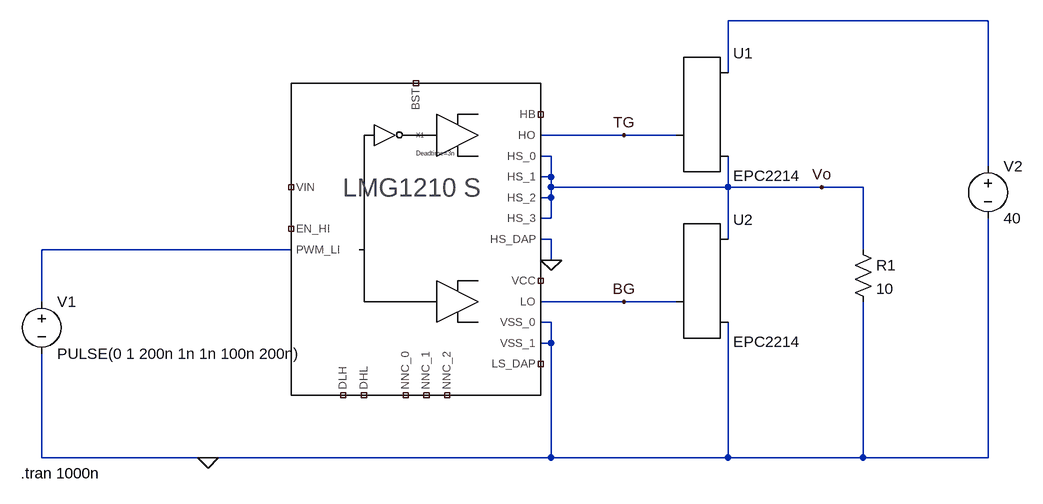
[diagram p0: schematic LMG1210-simple-test-circuit.asc]
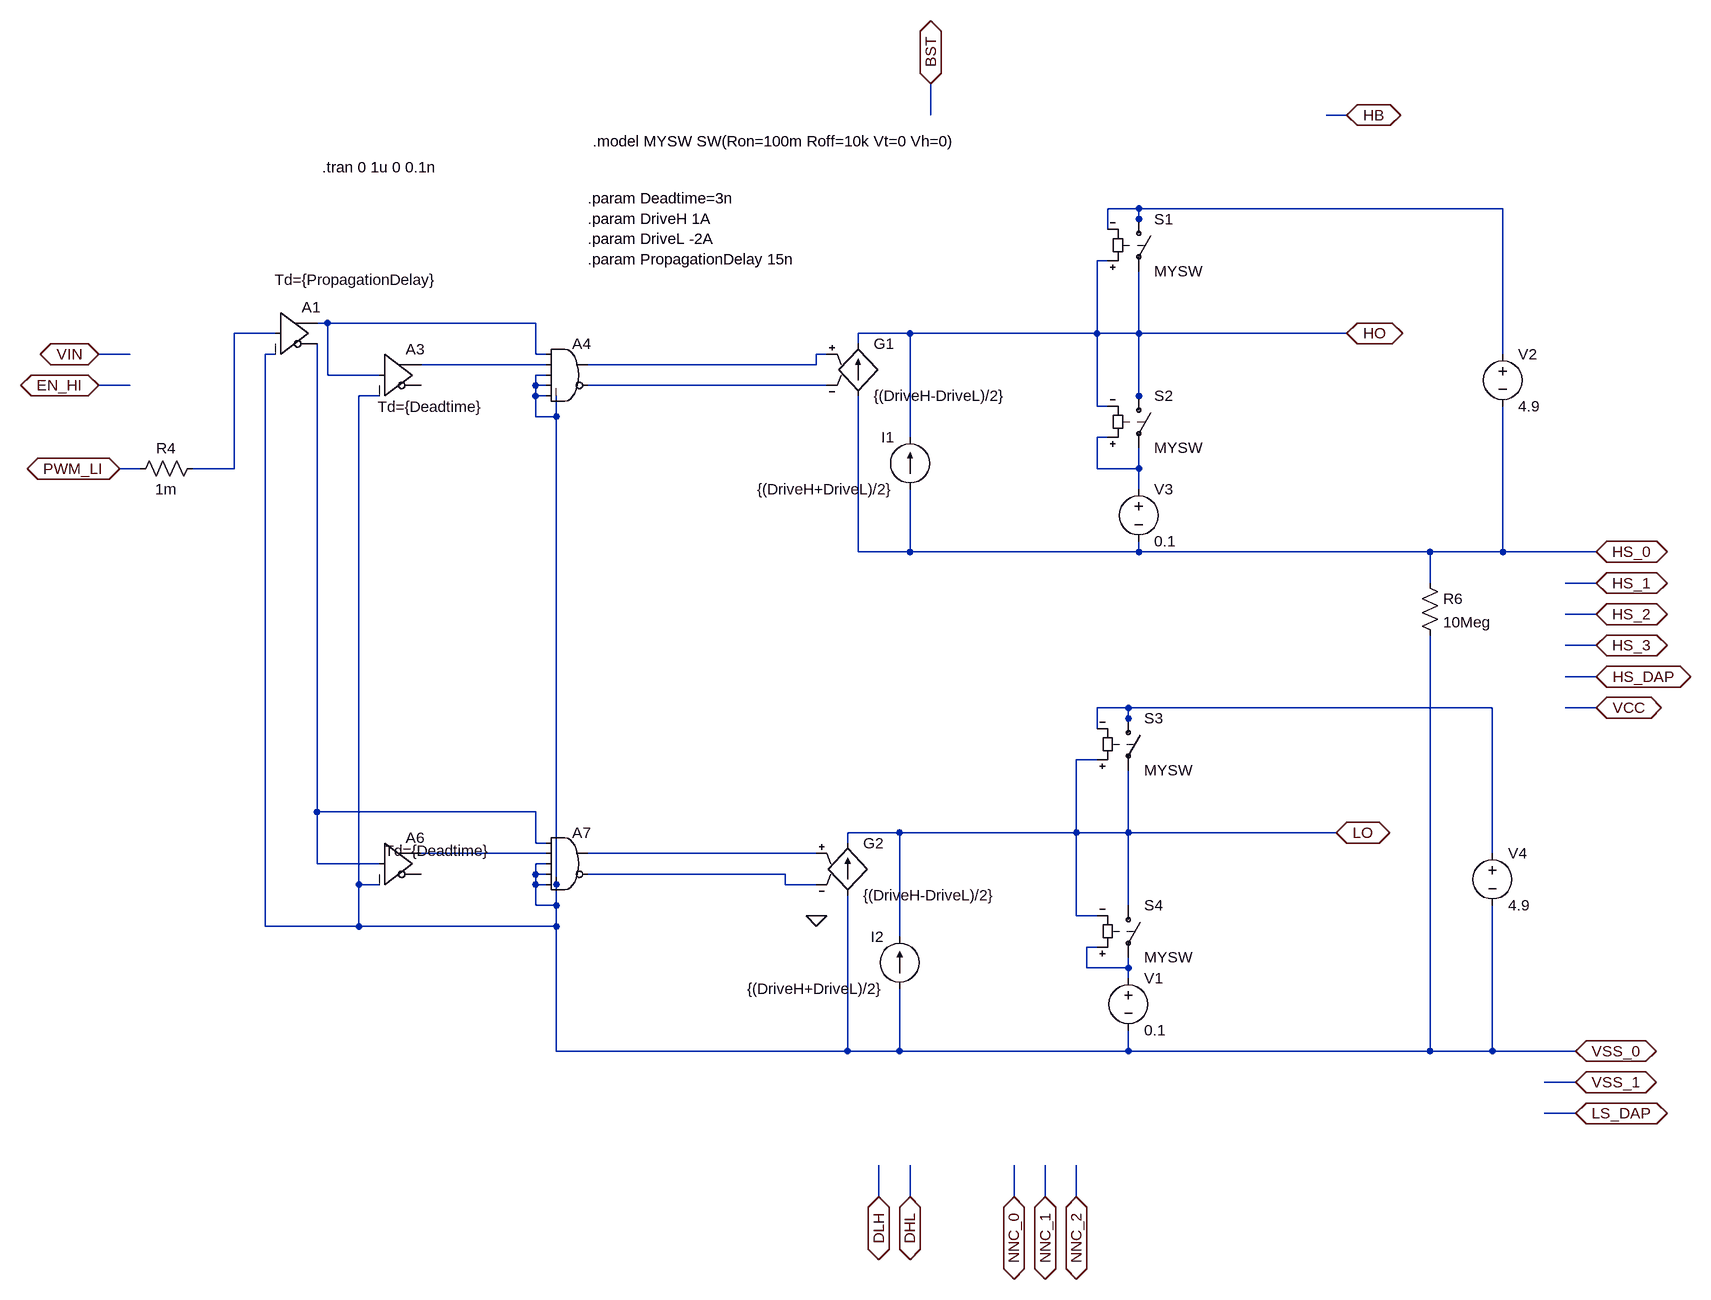
[diagram p1: sub-circuit lmg1210-simple.asc]
LMG1210-simple-test-circuit.asc, the LTspice schematic file:
Version 4
SHEET 1 1532 680
WIRE 1120 -208 720 -208
WIRE 720 -128 720 -208
WIRE 560 -32 432 -32
WIRE 640 -32 560 -32
WIRE 448 0 432 0
WIRE 1120 16 1120 -208
WIRE 448 32 448 0
WIRE 448 32 432 32
WIRE 448 48 448 32
WIRE 720 48 720 0
WIRE 720 48 448 48
WIRE 864 48 720 48
WIRE 928 48 864 48
WIRE 448 64 448 48
WIRE 448 64 432 64
WIRE 448 96 448 64
WIRE 448 96 432 96
WIRE 448 128 432 128
WIRE 720 128 720 48
WIRE 48 144 -336 144
WIRE 928 144 928 48
WIRE 448 160 448 128
WIRE -336 224 -336 144
WIRE 560 224 432 224
WIRE 640 224 560 224
WIRE 448 256 432 256
WIRE 448 288 448 256
WIRE 448 288 432 288
WIRE -336 464 -336 304
WIRE -80 464 -336 464
WIRE 448 464 448 288
WIRE 448 464 -80 464
WIRE 720 464 720 256
WIRE 720 464 448 464
WIRE 928 464 928 224
WIRE 928 464 720 464
WIRE 1120 464 1120 96
WIRE 1120 464 928 464
FLAG -80 464 0
FLAG 448 160 0
FLAG 560 -32 TG
FLAG 560 224 BG
FLAG 864 48 Vo
SYMBOL LMG1210-simple 240 -32 R0
WINDOW 0 0 0 Left 0
WINDOW 39 0 28 Left 0
SYMATTR InstName X1
SYMATTR SpiceLine Deadtime=3n
SYMBOL voltage -336 208 R0
WINDOW 123 0 0 Left 0
WINDOW 39 0 0 Left 0
SYMATTR InstName V1
SYMATTR Value PULSE(0 1 200n 1n 1n 100n 200n)
SYMBOL voltage 1120 0 R0
WINDOW 123 0 0 Left 0
WINDOW 39 0 0 Left 0
SYMATTR InstName V2
SYMATTR Value 40
SYMBOL res 912 128 R0
SYMATTR InstName R1
SYMATTR Value 10
SYMBOL EPCGaN 640 -32 R0
SYMATTR InstName U1
SYMATTR Value EPC2214
SYMBOL EPCGaN 640 224 R0
SYMATTR InstName U2
SYMATTR Value EPC2214
TEXT -368 488 Left 2 !.tran 1000n

lmg1210-simple.asc, the sub-circuit schematic file:
Version 4
SHEET 1 2328 1960
WIRE 912 -288 912 -336
WIRE 1552 -288 1520 -288
WIRE 1232 -144 1184 -144
WIRE 1792 -144 1232 -144
WIRE 1232 -128 1232 -144
WIRE 1184 -112 1184 -144
WIRE 1232 -112 1232 -128
WIRE 1184 -64 1168 -64
WIRE -16 32 -32 32
WIRE 304 32 -16 32
WIRE -96 48 -160 48
WIRE 880 48 800 48
WIRE 1168 48 1168 -64
WIRE 1168 48 880 48
WIRE 1232 48 1232 -48
WIRE 1232 48 1168 48
WIRE 1552 48 1232 48
WIRE 800 64 800 48
WIRE -320 80 -368 80
WIRE -96 80 -112 80
WIRE 304 80 304 32
WIRE 320 80 304 80
WIRE 752 80 736 80
WIRE 1792 80 1792 -144
WIRE 320 96 128 96
WIRE 736 96 736 80
WIRE 736 96 384 96
WIRE -16 112 -16 32
WIRE 64 112 -16 112
WIRE 320 112 304 112
WIRE -320 128 -368 128
WIRE 304 128 304 112
WIRE 320 128 304 128
WIRE 752 128 384 128
WIRE 64 144 32 144
WIRE 304 144 304 128
WIRE 320 144 304 144
WIRE 1232 144 1232 48
WIRE 1168 160 1168 48
WIRE 1184 160 1168 160
WIRE 1232 160 1232 144
WIRE 304 176 304 144
WIRE 336 176 336 144
WIRE 336 176 304 176
WIRE 880 208 880 48
WIRE 1184 208 1168 208
WIRE -304 256 -336 256
WIRE -160 256 -160 48
WIRE -160 256 -224 256
WIRE 1168 256 1168 208
WIRE 1232 256 1232 224
WIRE 1232 256 1168 256
WIRE 1232 288 1232 256
WIRE 800 384 800 144
WIRE 880 384 880 288
WIRE 880 384 800 384
WIRE 1232 384 1232 368
WIRE 1232 384 880 384
WIRE 1680 384 1232 384
WIRE 1792 384 1792 160
WIRE 1792 384 1680 384
WIRE 1936 384 1792 384
WIRE 1680 432 1680 384
WIRE 1936 432 1888 432
WIRE 1936 480 1888 480
WIRE 1936 528 1888 528
WIRE 1936 576 1888 576
WIRE 1216 624 1168 624
WIRE 1776 624 1216 624
WIRE 1936 624 1888 624
WIRE 1216 640 1216 624
WIRE 1168 656 1168 624
WIRE 1216 656 1216 640
WIRE 1168 704 1136 704
WIRE -32 784 -32 64
WIRE 304 784 -32 784
WIRE 864 816 784 816
WIRE 1136 816 1136 704
WIRE 1136 816 864 816
WIRE 1216 816 1216 720
WIRE 1216 816 1136 816
WIRE 1536 816 1216 816
WIRE 304 832 304 784
WIRE 320 832 304 832
WIRE 784 832 784 816
WIRE 320 848 128 848
WIRE 736 848 384 848
WIRE 1776 848 1776 624
WIRE -32 864 -32 784
WIRE 64 864 -32 864
WIRE 320 864 304 864
WIRE 304 880 304 864
WIRE 320 880 304 880
WIRE 688 880 384 880
WIRE 32 896 32 144
WIRE 64 896 32 896
WIRE 304 896 304 880
WIRE 320 896 304 896
WIRE 336 896 336 176
WIRE 688 896 688 880
WIRE 736 896 688 896
WIRE 304 928 304 896
WIRE 336 928 336 896
WIRE 336 928 304 928
WIRE 1216 928 1216 816
WIRE 1136 944 1136 816
WIRE 1168 944 1136 944
WIRE -112 960 -112 80
WIRE 32 960 32 896
WIRE 32 960 -112 960
WIRE 336 960 336 928
WIRE 336 960 32 960
WIRE 864 976 864 816
WIRE 1168 992 1152 992
WIRE 1152 1024 1152 992
WIRE 1216 1024 1216 1008
WIRE 1216 1024 1152 1024
WIRE 1216 1040 1216 1024
WIRE 336 1152 336 960
WIRE 784 1152 784 912
WIRE 784 1152 336 1152
WIRE 864 1152 864 1056
WIRE 864 1152 784 1152
WIRE 1216 1152 1216 1120
WIRE 1216 1152 864 1152
WIRE 1680 1152 1680 512
WIRE 1680 1152 1216 1152
WIRE 1776 1152 1776 928
WIRE 1776 1152 1680 1152
WIRE 1904 1152 1776 1152
WIRE 1904 1200 1856 1200
WIRE 1904 1248 1856 1248
WIRE 832 1376 832 1328
WIRE 880 1376 880 1328
WIRE 1040 1376 1040 1328
WIRE 1088 1376 1088 1328
WIRE 1136 1376 1136 1328
FLAG 1552 48 HO
IOPIN 1552 48 BiDir
FLAG 1936 384 HS_0
IOPIN 1936 384 BiDir
FLAG -336 256 PWM_LI
IOPIN -336 256 BiDir
FLAG 1536 816 LO
IOPIN 1536 816 BiDir
FLAG 1904 1152 VSS_0
IOPIN 1904 1152 BiDir
FLAG 1936 432 HS_1
IOPIN 1936 432 BiDir
FLAG 1936 480 HS_2
IOPIN 1936 480 BiDir
FLAG 1936 528 HS_3
IOPIN 1936 528 BiDir
FLAG 1936 576 HS_DAP
IOPIN 1936 576 BiDir
FLAG 1936 624 VCC
IOPIN 1936 624 BiDir
FLAG 1904 1200 VSS_1
IOPIN 1904 1200 BiDir
FLAG 1904 1248 LS_DAP
IOPIN 1904 1248 BiDir
FLAG 832 1376 DLH
IOPIN 832 1376 BiDir
FLAG 880 1376 DHL
IOPIN 880 1376 BiDir
FLAG -368 80 VIN
IOPIN -368 80 BiDir
FLAG -368 128 EN_HI
IOPIN -368 128 BiDir
FLAG 912 -336 BST
IOPIN 912 -336 BiDir
FLAG 1552 -288 HB
IOPIN 1552 -288 BiDir
FLAG 1040 1376 NNC_0
IOPIN 1040 1376 BiDir
FLAG 1088 1376 NNC_1
IOPIN 1088 1376 BiDir
FLAG 1136 1376 NNC_2
IOPIN 1136 1376 BiDir
FLAG 736 944 0
SYMBOL res -208 240 R90
WINDOW 0 0 56 VBottom 2
WINDOW 3 32 56 VTop 2
SYMATTR InstName R4
SYMATTR Value 1m
SYMBOL Digital\\buf -96 -16 R0
WINDOW 3 -1 -19 Left 2
SYMATTR Value Td={PropagationDelay}
SYMATTR InstName A1
SYMBOL Digital\\buf 64 48 R0
WINDOW 3 -3 113 Left 2
SYMATTR Value Td={Deadtime}
SYMATTR InstName A3
SYMBOL Digital\\and 352 48 R0
SYMATTR InstName A4
SYMBOL Digital\\buf 64 800 R0
WINDOW 3 8 44 Left 2
SYMATTR Value Td={Deadtime}
SYMATTR InstName A6
SYMBOL Digital\\and 352 800 R0
SYMATTR InstName A7
SYMBOL voltage 1792 64 R0
WINDOW 123 0 0 Left 0
WINDOW 39 0 0 Left 0
SYMATTR InstName V2
SYMATTR Value 4.9
SYMBOL res 1664 416 R0
SYMATTR InstName R6
SYMATTR Value 10Meg
SYMBOL voltage 1232 272 R0
WINDOW 123 0 0 Left 0
WINDOW 39 0 0 Left 0
SYMATTR InstName V3
SYMATTR Value 0.1
SYMBOL voltage 1776 832 R0
WINDOW 123 0 0 Left 0
WINDOW 39 0 0 Left 0
SYMATTR InstName V4
SYMATTR Value 4.9
SYMBOL sw 1232 -144 R0
SYMATTR InstName S1
SYMATTR Value MYSW
SYMBOL sw 1232 128 R0
SYMATTR InstName S2
SYMATTR Value MYSW
SYMBOL current 880 288 R180
WINDOW 0 24 80 Left 2
WINDOW 3 24 0 Left 2
WINDOW 123 0 0 Left 0
WINDOW 39 0 0 Left 0
SYMATTR InstName I1
SYMATTR Value {(DriveH+DriveL)/2}
SYMBOL g 800 48 R0
SYMATTR InstName G1
SYMATTR Value {(DriveH-DriveL)/2}
SYMBOL current 864 1056 R180
WINDOW 0 24 80 Left 2
WINDOW 3 24 0 Left 2
WINDOW 123 0 0 Left 0
WINDOW 39 0 0 Left 0
SYMATTR InstName I2
SYMATTR Value {(DriveH+DriveL)/2}
SYMBOL g 784 816 R0
SYMATTR InstName G2
SYMATTR Value {(DriveH-DriveL)/2}
SYMBOL sw 1216 624 R0
SYMATTR InstName S3
SYMATTR Value MYSW
SYMBOL sw 1216 912 R0
SYMATTR InstName S4
SYMATTR Value MYSW
SYMBOL voltage 1216 1024 R0
WINDOW 123 0 0 Left 0
WINDOW 39 0 0 Left 0
SYMATTR InstName V1
SYMATTR Value 0.1
TEXT -24 -208 Left 2 !.tran 0 1u 0 0.1n
TEXT 384 -160 Left 2 !.param Deadtime=3n\n.param DriveH 1A\n.param DriveL -2A\n.param PropagationDelay 15n
TEXT 392 -248 Left 2 !.model MYSW SW(Ron=100m Roff=10k Vt=0 Vh=0)

The netlist it stands for:
* LMG1210-simple-test-circuit.asc
XX1 NC_01 TG N002 Vo Vo Vo Vo 0 NC_02 NC_03 BG NC_04 NC_05 NC_06 0 0 NC_07 NC_08 NC_09 NC_10 NC_11 lmg1210-simple params: Deadtime=3n
V1 N002 0 PULSE(0 1 200n 1n 1n 100n 200n)
V2 N001 0 40
R1 Vo 0 10
XU1 TG N001 Vo EPC2214
XU2 BG Vo 0 EPC2214

* block symbol definitions
.subckt lmg1210-simple HB HO PWM_LI HS_0 HS_1 HS_2 HS_3 HS_DAP LS_DAP VIN LO DHL DLH VCC VSS_0 VSS_1 EN_HI NNC_0 NNC_1 NNC_2 BST
R4 N003 PWM_LI 1m
A1 N003 VSS_0 VSS_0 VSS_0 VSS_0 N009 N002 VSS_0 BUF Td={PropagationDelay}
A3 N002 VSS_0 VSS_0 VSS_0 VSS_0 VSS_0 N005 VSS_0 BUF Td={Deadtime}
A4 N002 N005 VSS_0 VSS_0 VSS_0 N006 N004 VSS_0 AND
A6 N009 VSS_0 VSS_0 VSS_0 VSS_0 VSS_0 N010 VSS_0 BUF Td={Deadtime}
A7 N009 N010 VSS_0 VSS_0 VSS_0 N012 N011 VSS_0 AND
V2 N001 HS_0 4.9
R6 HS_0 VSS_0 10Meg
V3 N007 HS_0 0.1
V4 N008 VSS_0 4.9
S1 N001 HO HO N001 MYSW
S2 HO N007 N007 HO MYSW
I1 HS_0 HO {(DriveH+DriveL)/2}
G1 HS_0 HO N004 N006 {(DriveH-DriveL)/2}
I2 VSS_0 LO {(DriveH+DriveL)/2}
G2 VSS_0 LO N011 N012 {(DriveH-DriveL)/2}
S3 N008 LO LO N008 MYSW
S4 LO N013 N013 LO MYSW
V1 N013 VSS_0 0.1
.tran 0 1u 0 0.1n
.param Deadtime=3n
.param DriveH 1A
.param DriveL -2A
.param PropagationDelay 15n
.model MYSW SW(Ron=100m Roff=10k Vt=0 Vh=0)
.ends lmg1210-simple

.tran 1000n
.backanno
.end